# EAGLE schematic DRI-21700-flexpcb-12s4p (EAGLE 9.6.1)
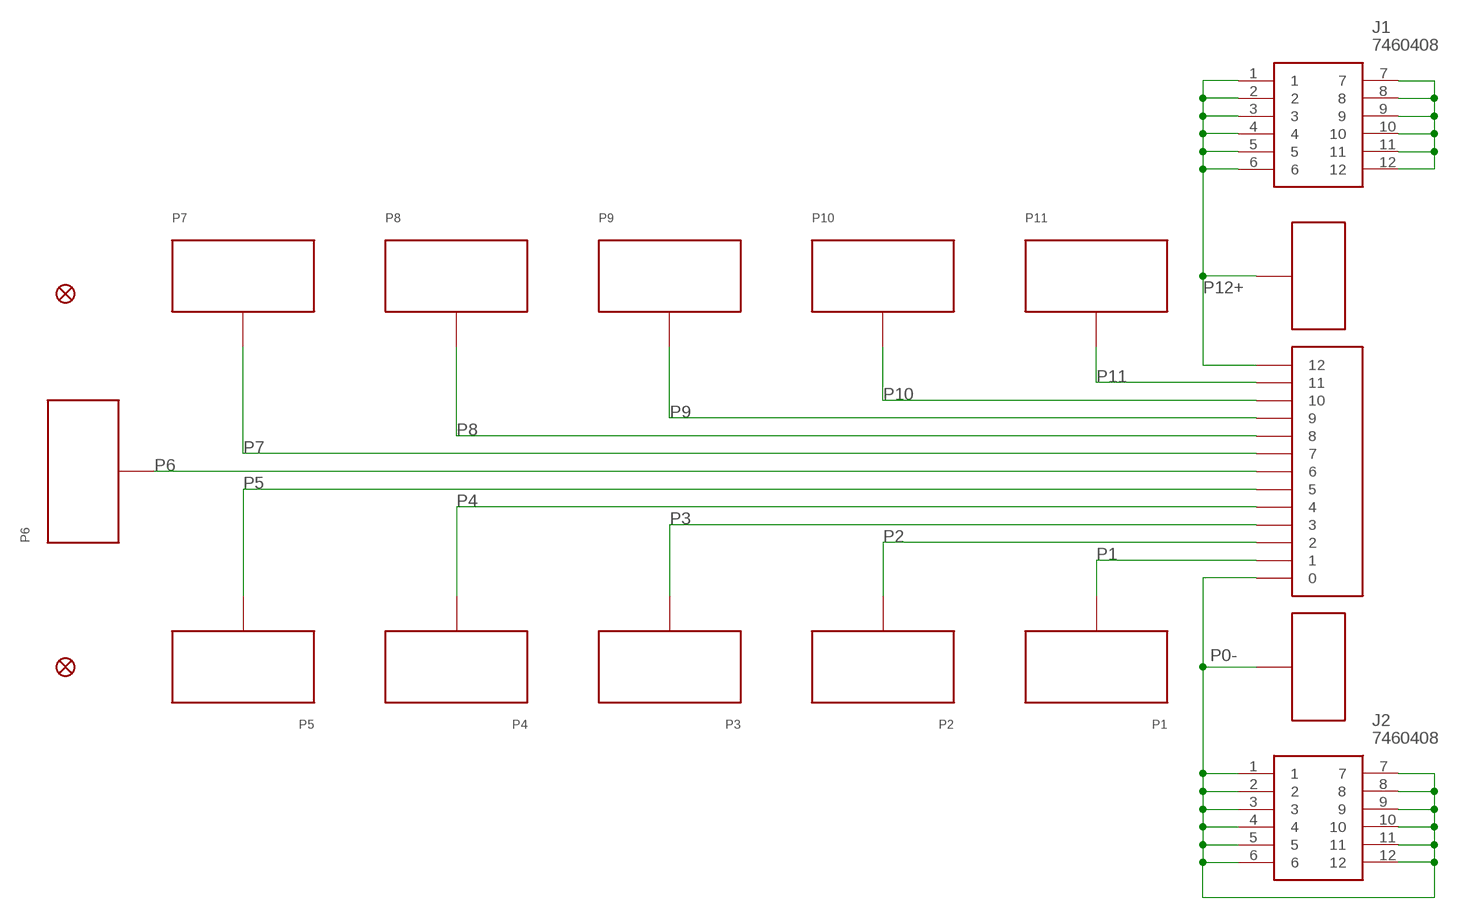
[diagram p0: schematic, sheet 1]

## Parts
FD1  FIDUCIAL1X2  [FIDUCIAL-1X2]
FD2  FIDUCIAL1X2  [FIDUCIAL-1X2]
J1  7460408  [7460408]
J2  7460408  [7460408]
JP1  13P-JST-2MM  [13P-JST-2MM]
P0  BUS-TERM-PAD+  [TERM-PAD-]
P1  BAT-TERM-L  [BAT-TERM-L]
P2  BAT-TERM-M  [BAT-TERM-M]
P3  BAT-TERM-L  [BAT-TERM-L]
P4  BAT-TERM-M  [BAT-TERM-M]
P5  BAT-TERM-L  [BAT-TERM-L]
P6  BAT-TERM-END  [BAT-TERM-END]
P7  BAT-TERM-L  [BAT-TERM-L]
P8  BAT-TERM-M  [BAT-TERM-M]
P9  BAT-TERM-L  [BAT-TERM-L]
P10  BAT-TERM-M  [BAT-TERM-M]
P11  BAT-TERM-L  [BAT-TERM-L]
P12  BUS-TERM-PAD+  [TERM-PAD-]

## Nets
N$2: J1.7 J1.8 J1.9 J1.10 J1.11 J1.12
P0-: J2.1 J2.2 J2.3 J2.4 J2.5 J2.6 J2.7 J2.8 J2.9 J2.10 J2.11 J2.12 JP1.P$1 P0.P$3 P0.P$4 P0.P$5 P0.P$6 P0.P$7 P0.P$8 P0.P$9 P0.P$10 P0.P$11 P0.P$12 P0.P$13 P0.P$14 P0.P$15 P0.P$16 P0.P$17 P0.P$18 P0.P$19 P0.P$20 P0.P$21 P0.P$22 P0.P$23 P0.P$24 P0.P$25 P0.P$26 P0.P$27 P0.P$28 P0.P$29 P0.P$30 P0.P$31 P0.P$32 P0.P$33 P0.P$34 P0.P$35 P0.P$36 P0.P$37 P0.P$38 P0.P$39 P0.P$40 P0.P$41 P0.P$42 P0.P$43 P0.P$44 P0.P$45 P0.P$46 P0.P$47 P0.P$48 P0.P$49 P0.P$50 P0.P$51 P0.P$52 P0.P$53 P0.P$54 P0.P$55 P0.P$56 P0.P$57 P0.P$58 P0.P$59 P0.P$60 P0.P$61 P0.P$62 P0.P$63 P0.P$64 P0.P$65 P0.P$66 P0.P$67 P0.P$68 P0.P$69 P0.P$70 P0.P$71 P0.P$72 P0.P$73 P0.P$74 P0.P$75 P0.P$76 P0.P$77 P0.P$78 P0.P$79 P0.P$80 P0.P$81 P0.P$82 P0.P$83 P0.P$84 P0.P$85 P0.P$86 P0.P$87 P0.P$88 P0.P$89 P0.P$90 P0.P$91 P0.P$92 P0.P$93 P0.P$94 P0.P$95 P0.P$96 P0.P$97 P0.P$98 P0.P$99 P0.P$100 P0.P$101 P0.P$102 P0.P$103 P0.P$104 P0.P$105 P0.P$106 P0.P$107 P0.P$108 P0.P$109 P0.P$110 P0.P$181 P0.P$182 P0.P$183 P0.P$184 P0.P$185 P0.P$186 P0.P$187 P0.P$188 P0.P$189 P0.P$190 P0.P$191 P0.P$192 P0.P$193 P0.P$194 P0.P$195 P0.P$196 P0.P$197 P0.P$198 P0.P$199 P0.P$200 P0.P$201 P0.P$202 P0.P$203 P0.P$204 P0.P$205 P0.P$206 P0.P$207 P0.P$208 P0.P$209 P0.P$210 P0.P$211 P0.P$212 P0.P$213 P0.P$214 P0.P$215 P0.P$216 P0.P$217 P0.P$218 P0.P$219 P0.P$220 P0.P$221 P0.P$222 P0.P$223 P0.P$224 P0.P$225 P0.P$226 P0.P$227 P0.P$228 P0.P$229 P0.P$230 P0.P$231 P0.P$232 P0.P$233 P0.P$234 P0.P$235 P0.P$236 P0.P$237 P0.P$238 P0.P$239 P0.P$240 P0.P$241 P0.P$242 P0.P$243 P0.P$244 P0.P$245 P0.P$246 P0.P$247 P0.P$248 P0.P$249 P0.P$250 P0.P$251 P0.P$252 P0.P$253 P0.P$254 P0.P$255 P0.P$256 P0.P$257 P0.P$258 P0.P$259 P0.P$260 P0.P$261 P0.P$262 P0.P$263 P0.P$264 P0.P$265 P0.P$266 P0.P$267 P0.P$268 P0.P$269 P0.P$270 P0.P$271 P0.P$272 P0.P$273 P0.P$274 P0.P$275 P0.P$276 P0.P$277 P0.P$278 P0.P$279 P0.P$280 P0.P$281 P0.P$282 P0.P$283 P0.P$284 P0.P$285 P0.P$286 P0.P$287 P0.P$288 P0.P$289 P0.P$290 P0.P$291 P0.P$292 P0.P$293 P0.P$294 P0.P$295 P0.P$296 P0.P$297 P0.P$298 P0.P$299 P0.P$300 P0.P$301 P0.P$302 P0.P$303 P0.P$304 P0.P$305 P0.P$306 P0.P$307 P0.P$308 P0.P$309 P0.P$310 P0.P$311 P0.P$312 P0.P$313 P0.P$314 P0.P$315 P0.P$316 P0.P$317 P0.P$318 P0.P$319 P0.P$320 P0.P$321 P0.P$322 P0.P$323 P0.P$324 P0.P$325 P0.P$326 P0.P$327 P0.P$328 P0.P$329 P0.P$330 P0.P$331 P0.P$332 P0.P$333 P0.P$334 P0.P$335 P0.P$336 P0.P$337 P0.P$338 P0.P$339 P0.P$340 P0.P$341 P0.P$342 P0.P$343 P0.P$344 P0.P$345 P0.P$346 P0.P$347 P0.P$348 P0.P$349 P0.P$350 P0.P$351 P0.P$352 P0.P$353 P0.P$354 P0.P$355 P0.P$356 P0.P$357 P0.P$358 P0.P$359 P0.P$360
P1: JP1.P$2 P1.P$5 P1.P$6 P1.P$7 P1.P$8 P1.P$9 P1.P$10 P1.P$11 P1.P$12 P1.P$13 P1.P$14 P1.P$15 P1.P$16 P1.P$17 P1.P$18 P1.P$19 P1.P$20 P1.P$21 P1.P$22 P1.P$23 P1.P$24 P1.P$25 P1.P$26 P1.P$27 P1.P$28 P1.P$29 P1.P$30 P1.P$31 P1.P$32 P1.P$33 P1.P$34 P1.P$35 P1.P$36 P1.P$37 P1.P$38 P1.P$39 P1.P$40 P1.P$41 P1.P$42 P1.P$43 P1.P$44 P1.P$45 P1.P$46 P1.P$47 P1.P$48 P1.P$49 P1.P$50 P1.P$51 P1.P$52 P1.P$53 P1.P$54 P1.P$55 P1.P$56 P1.P$57 P1.P$58 P1.P$59 P1.P$60 P1.P$61 P1.P$62 P1.P$63 P1.P$64 P1.P$65 P1.P$66 P1.P$67 P1.P$68 P1.P$69 P1.P$70 P1.P$71 P1.P$72 P1.P$73 P1.P$74 P1.P$75 P1.P$76 P1.P$77 P1.P$78 P1.P$79 P1.P$80 P1.P$81 P1.P$82 P1.P$83 P1.P$84 P1.P$85 P1.P$86 P1.P$87 P1.P$88 P1.P$89 P1.P$90 P1.P$91 P1.P$92 P1.P$93 P1.P$94 P1.P$95 P1.P$96 P1.P$97 P1.P$98 P1.P$99 P1.P$100 P1.P$101 P1.P$102 P1.P$103 P1.P$104 P1.P$105 P1.P$106 P1.P$107 P1.P$108 P1.P$109 P1.P$110 P1.P$111 P1.P$112 P1.P$114 P1.P$115 P1.P$116 P1.P$117 P1.P$118 P1.P$119 P1.P$120 P1.P$121 P1.P$122 P1.P$123 P1.P$124 P1.P$125 P1.P$126 P1.P$127 P1.P$128 P1.P$129 P1.P$130 P1.P$131 P1.P$132 P1.P$133 P1.P$134 P1.P$135 P1.P$136 P1.P$137 P1.P$138 P1.P$139 P1.P$140 P1.P$141 P1.P$142 P1.P$143 P1.P$144 P1.P$145 P1.P$146 P1.P$147 P1.P$148 P1.P$149 P1.P$151 P1.P$152 P1.P$153 P1.P$154 P1.P$155 P1.P$156 P1.P$157 P1.P$158 P1.P$159 P1.P$160 P1.P$161 P1.P$162 P1.P$163 P1.P$164 P1.P$165 P1.P$166 P1.P$167 P1.P$168 P1.P$169 P1.P$170 P1.P$171 P1.P$172 P1.P$173 P1.P$174 P1.P$175 P1.P$176 P1.P$177 P1.P$178 P1.P$179 P1.P$180 P1.P$181 P1.P$182 P1.P$183 P1.P$184 P1.P$185 P1.P$186 P1.P$188 P1.P$189 P1.P$190 P1.P$191 P1.P$192 P1.P$193 P1.P$194 P1.P$195 P1.P$196 P1.P$197 P1.P$198 P1.P$199 P1.P$200 P1.P$201 P1.P$202 P1.P$203 P1.P$204 P1.P$205 P1.P$206 P1.P$207 P1.P$208 P1.P$209 P1.P$210 P1.P$211 P1.P$212 P1.P$213 P1.P$214 P1.P$215 P1.P$216 P1.P$217 P1.P$218 P1.P$219 P1.P$220 P1.P$221 P1.P$222 P1.P$223
P2: JP1.P$3 P2.P$5 P2.P$6 P2.P$7 P2.P$8 P2.P$9 P2.P$10 P2.P$11 P2.P$12 P2.P$13 P2.P$14 P2.P$15 P2.P$16 P2.P$17 P2.P$18 P2.P$19 P2.P$20 P2.P$21 P2.P$22 P2.P$23 P2.P$24 P2.P$25 P2.P$26 P2.P$27 P2.P$28 P2.P$29 P2.P$30 P2.P$31 P2.P$32 P2.P$33 P2.P$34 P2.P$35 P2.P$36 P2.P$37 P2.P$38 P2.P$39 P2.P$40 P2.P$42 P2.P$43 P2.P$44 P2.P$45 P2.P$46 P2.P$47 P2.P$48 P2.P$49 P2.P$50 P2.P$51 P2.P$52 P2.P$53 P2.P$54 P2.P$55 P2.P$56 P2.P$57 P2.P$58 P2.P$59 P2.P$60 P2.P$61 P2.P$62 P2.P$63 P2.P$64 P2.P$65 P2.P$66 P2.P$67 P2.P$68 P2.P$69 P2.P$70 P2.P$71 P2.P$72 P2.P$73 P2.P$74 P2.P$75 P2.P$76 P2.P$77 P2.P$79 P2.P$80 P2.P$81 P2.P$82 P2.P$83 P2.P$84 P2.P$85 P2.P$86 P2.P$87 P2.P$88 P2.P$89 P2.P$90 P2.P$91 P2.P$92 P2.P$93 P2.P$94 P2.P$95 P2.P$96 P2.P$97 P2.P$98 P2.P$99 P2.P$100 P2.P$101 P2.P$102 P2.P$103 P2.P$104 P2.P$105 P2.P$106 P2.P$107 P2.P$108 P2.P$109 P2.P$110 P2.P$111 P2.P$112 P2.P$113 P2.P$114 P2.P$116 P2.P$117 P2.P$118 P2.P$119 P2.P$120 P2.P$121 P2.P$122 P2.P$123 P2.P$124 P2.P$125 P2.P$126 P2.P$127 P2.P$128 P2.P$129 P2.P$130 P2.P$131 P2.P$132 P2.P$133 P2.P$134 P2.P$135 P2.P$136 P2.P$137 P2.P$138 P2.P$139 P2.P$140 P2.P$141 P2.P$142 P2.P$143 P2.P$144 P2.P$145 P2.P$146 P2.P$147 P2.P$148 P2.P$149 P2.P$150 P2.P$151 P2.P$153 P2.P$154 P2.P$155 P2.P$156 P2.P$157 P2.P$158 P2.P$159 P2.P$160 P2.P$161 P2.P$162 P2.P$163 P2.P$164 P2.P$165 P2.P$166 P2.P$167 P2.P$168 P2.P$169 P2.P$170 P2.P$171 P2.P$172 P2.P$173 P2.P$174 P2.P$175 P2.P$176 P2.P$177 P2.P$178 P2.P$179 P2.P$180 P2.P$181 P2.P$182 P2.P$183 P2.P$184 P2.P$185 P2.P$186 P2.P$187 P2.P$188 P2.P$190 P2.P$191 P2.P$192 P2.P$193 P2.P$194 P2.P$195 P2.P$196 P2.P$197 P2.P$198 P2.P$199 P2.P$200 P2.P$201 P2.P$202 P2.P$203 P2.P$204 P2.P$205 P2.P$206 P2.P$207 P2.P$208 P2.P$209 P2.P$210 P2.P$211 P2.P$212 P2.P$213 P2.P$214 P2.P$215 P2.P$216 P2.P$217 P2.P$218 P2.P$219 P2.P$220 P2.P$221 P2.P$222 P2.P$223 P2.P$224 P2.P$225
P3: JP1.P$4 P3.P$5 P3.P$6 P3.P$7 P3.P$8 P3.P$9 P3.P$10 P3.P$11 P3.P$12 P3.P$13 P3.P$14 P3.P$15 P3.P$16 P3.P$17 P3.P$18 P3.P$19 P3.P$20 P3.P$21 P3.P$22 P3.P$23 P3.P$24 P3.P$25 P3.P$26 P3.P$27 P3.P$28 P3.P$29 P3.P$30 P3.P$31 P3.P$32 P3.P$33 P3.P$34 P3.P$35 P3.P$36 P3.P$37 P3.P$38 P3.P$39 P3.P$40 P3.P$41 P3.P$42 P3.P$43 P3.P$44 P3.P$45 P3.P$46 P3.P$47 P3.P$48 P3.P$49 P3.P$50 P3.P$51 P3.P$52 P3.P$53 P3.P$54 P3.P$55 P3.P$56 P3.P$57 P3.P$58 P3.P$59 P3.P$60 P3.P$61 P3.P$62 P3.P$63 P3.P$64 P3.P$65 P3.P$66 P3.P$67 P3.P$68 P3.P$69 P3.P$70 P3.P$71 P3.P$72 P3.P$73 P3.P$74 P3.P$75 P3.P$76 P3.P$77 P3.P$78 P3.P$79 P3.P$80 P3.P$81 P3.P$82 P3.P$83 P3.P$84 P3.P$85 P3.P$86 P3.P$87 P3.P$88 P3.P$89 P3.P$90 P3.P$91 P3.P$92 P3.P$93 P3.P$94 P3.P$95 P3.P$96 P3.P$97 P3.P$98 P3.P$99 P3.P$100 P3.P$101 P3.P$102 P3.P$103 P3.P$104 P3.P$105 P3.P$106 P3.P$107 P3.P$108 P3.P$109 P3.P$110 P3.P$111 P3.P$112 P3.P$114 P3.P$115 P3.P$116 P3.P$117 P3.P$118 P3.P$119 P3.P$120 P3.P$121 P3.P$122 P3.P$123 P3.P$124 P3.P$125 P3.P$126 P3.P$127 P3.P$128 P3.P$129 P3.P$130 P3.P$131 P3.P$132 P3.P$133 P3.P$134 P3.P$135 P3.P$136 P3.P$137 P3.P$138 P3.P$139 P3.P$140 P3.P$141 P3.P$142 P3.P$143 P3.P$144 P3.P$145 P3.P$146 P3.P$147 P3.P$148 P3.P$149 P3.P$151 P3.P$152 P3.P$153 P3.P$154 P3.P$155 P3.P$156 P3.P$157 P3.P$158 P3.P$159 P3.P$160 P3.P$161 P3.P$162 P3.P$163 P3.P$164 P3.P$165 P3.P$166 P3.P$167 P3.P$168 P3.P$169 P3.P$170 P3.P$171 P3.P$172 P3.P$173 P3.P$174 P3.P$175 P3.P$176 P3.P$177 P3.P$178 P3.P$179 P3.P$180 P3.P$181 P3.P$182 P3.P$183 P3.P$184 P3.P$185 P3.P$186 P3.P$188 P3.P$189 P3.P$190 P3.P$191 P3.P$192 P3.P$193 P3.P$194 P3.P$195 P3.P$196 P3.P$197 P3.P$198 P3.P$199 P3.P$200 P3.P$201 P3.P$202 P3.P$203 P3.P$204 P3.P$205 P3.P$206 P3.P$207 P3.P$208 P3.P$209 P3.P$210 P3.P$211 P3.P$212 P3.P$213 P3.P$214 P3.P$215 P3.P$216 P3.P$217 P3.P$218 P3.P$219 P3.P$220 P3.P$221 P3.P$222 P3.P$223
P4: JP1.P$5 P4.P$5 P4.P$6 P4.P$7 P4.P$8 P4.P$9 P4.P$10 P4.P$11 P4.P$12 P4.P$13 P4.P$14 P4.P$15 P4.P$16 P4.P$17 P4.P$18 P4.P$19 P4.P$20 P4.P$21 P4.P$22 P4.P$23 P4.P$24 P4.P$25 P4.P$26 P4.P$27 P4.P$28 P4.P$29 P4.P$30 P4.P$31 P4.P$32 P4.P$33 P4.P$34 P4.P$35 P4.P$36 P4.P$37 P4.P$38 P4.P$39 P4.P$40 P4.P$42 P4.P$43 P4.P$44 P4.P$45 P4.P$46 P4.P$47 P4.P$48 P4.P$49 P4.P$50 P4.P$51 P4.P$52 P4.P$53 P4.P$54 P4.P$55 P4.P$56 P4.P$57 P4.P$58 P4.P$59 P4.P$60 P4.P$61 P4.P$62 P4.P$63 P4.P$64 P4.P$65 P4.P$66 P4.P$67 P4.P$68 P4.P$69 P4.P$70 P4.P$71 P4.P$72 P4.P$73 P4.P$74 P4.P$75 P4.P$76 P4.P$77 P4.P$79 P4.P$80 P4.P$81 P4.P$82 P4.P$83 P4.P$84 P4.P$85 P4.P$86 P4.P$87 P4.P$88 P4.P$89 P4.P$90 P4.P$91 P4.P$92 P4.P$93 P4.P$94 P4.P$95 P4.P$96 P4.P$97 P4.P$98 P4.P$99 P4.P$100 P4.P$101 P4.P$102 P4.P$103 P4.P$104 P4.P$105 P4.P$106 P4.P$107 P4.P$108 P4.P$109 P4.P$110 P4.P$111 P4.P$112 P4.P$113 P4.P$114 P4.P$116 P4.P$117 P4.P$118 P4.P$119 P4.P$120 P4.P$121 P4.P$122 P4.P$123 P4.P$124 P4.P$125 P4.P$126 P4.P$127 P4.P$128 P4.P$129 P4.P$130 P4.P$131 P4.P$132 P4.P$133 P4.P$134 P4.P$135 P4.P$136 P4.P$137 P4.P$138 P4.P$139 P4.P$140 P4.P$141 P4.P$142 P4.P$143 P4.P$144 P4.P$145 P4.P$146 P4.P$147 P4.P$148 P4.P$149 P4.P$150 P4.P$151 P4.P$153 P4.P$154 P4.P$155 P4.P$156 P4.P$157 P4.P$158 P4.P$159 P4.P$160 P4.P$161 P4.P$162 P4.P$163 P4.P$164 P4.P$165 P4.P$166 P4.P$167 P4.P$168 P4.P$169 P4.P$170 P4.P$171 P4.P$172 P4.P$173 P4.P$174 P4.P$175 P4.P$176 P4.P$177 P4.P$178 P4.P$179 P4.P$180 P4.P$181 P4.P$182 P4.P$183 P4.P$184 P4.P$185 P4.P$186 P4.P$187 P4.P$188 P4.P$190 P4.P$191 P4.P$192 P4.P$193 P4.P$194 P4.P$195 P4.P$196 P4.P$197 P4.P$198 P4.P$199 P4.P$200 P4.P$201 P4.P$202 P4.P$203 P4.P$204 P4.P$205 P4.P$206 P4.P$207 P4.P$208 P4.P$209 P4.P$210 P4.P$211 P4.P$212 P4.P$213 P4.P$214 P4.P$215 P4.P$216 P4.P$217 P4.P$218 P4.P$219 P4.P$220 P4.P$221 P4.P$222 P4.P$223 P4.P$224 P4.P$225
P5: JP1.P$6 P5.P$5 P5.P$6 P5.P$7 P5.P$8 P5.P$9 P5.P$10 P5.P$11 P5.P$12 P5.P$13 P5.P$14 P5.P$15 P5.P$16 P5.P$17 P5.P$18 P5.P$19 P5.P$20 P5.P$21 P5.P$22 P5.P$23 P5.P$24 P5.P$25 P5.P$26 P5.P$27 P5.P$28 P5.P$29 P5.P$30 P5.P$31 P5.P$32 P5.P$33 P5.P$34 P5.P$35 P5.P$36 P5.P$37 P5.P$38 P5.P$39 P5.P$40 P5.P$41 P5.P$42 P5.P$43 P5.P$44 P5.P$45 P5.P$46 P5.P$47 P5.P$48 P5.P$49 P5.P$50 P5.P$51 P5.P$52 P5.P$53 P5.P$54 P5.P$55 P5.P$56 P5.P$57 P5.P$58 P5.P$59 P5.P$60 P5.P$61 P5.P$62 P5.P$63 P5.P$64 P5.P$65 P5.P$66 P5.P$67 P5.P$68 P5.P$69 P5.P$70 P5.P$71 P5.P$72 P5.P$73 P5.P$74 P5.P$75 P5.P$76 P5.P$77 P5.P$78 P5.P$79 P5.P$80 P5.P$81 P5.P$82 P5.P$83 P5.P$84 P5.P$85 P5.P$86 P5.P$87 P5.P$88 P5.P$89 P5.P$90 P5.P$91 P5.P$92 P5.P$93 P5.P$94 P5.P$95 P5.P$96 P5.P$97 P5.P$98 P5.P$99 P5.P$100 P5.P$101 P5.P$102 P5.P$103 P5.P$104 P5.P$105 P5.P$106 P5.P$107 P5.P$108 P5.P$109 P5.P$110 P5.P$111 P5.P$112 P5.P$114 P5.P$115 P5.P$116 P5.P$117 P5.P$118 P5.P$119 P5.P$120 P5.P$121 P5.P$122 P5.P$123 P5.P$124 P5.P$125 P5.P$126 P5.P$127 P5.P$128 P5.P$129 P5.P$130 P5.P$131 P5.P$132 P5.P$133 P5.P$134 P5.P$135 P5.P$136 P5.P$137 P5.P$138 P5.P$139 P5.P$140 P5.P$141 P5.P$142 P5.P$143 P5.P$144 P5.P$145 P5.P$146 P5.P$147 P5.P$148 P5.P$149 P5.P$151 P5.P$152 P5.P$153 P5.P$154 P5.P$155 P5.P$156 P5.P$157 P5.P$158 P5.P$159 P5.P$160 P5.P$161 P5.P$162 P5.P$163 P5.P$164 P5.P$165 P5.P$166 P5.P$167 P5.P$168 P5.P$169 P5.P$170 P5.P$171 P5.P$172 P5.P$173 P5.P$174 P5.P$175 P5.P$176 P5.P$177 P5.P$178 P5.P$179 P5.P$180 P5.P$181 P5.P$182 P5.P$183 P5.P$184 P5.P$185 P5.P$186 P5.P$188 P5.P$189 P5.P$190 P5.P$191 P5.P$192 P5.P$193 P5.P$194 P5.P$195 P5.P$196 P5.P$197 P5.P$198 P5.P$199 P5.P$200 P5.P$201 P5.P$202 P5.P$203 P5.P$204 P5.P$205 P5.P$206 P5.P$207 P5.P$208 P5.P$209 P5.P$210 P5.P$211 P5.P$212 P5.P$213 P5.P$214 P5.P$215 P5.P$216 P5.P$217 P5.P$218 P5.P$219 P5.P$220 P5.P$221 P5.P$222 P5.P$223
P6: JP1.P$7 P6.P$2 P6.P$3 P6.P$4 P6.P$5 P6.P$6 P6.P$7 P6.P$8 P6.P$9 P6.P$10 P6.P$11 P6.P$12 P6.P$13 P6.P$14 P6.P$15 P6.P$16 P6.P$17 P6.P$18 P6.P$19 P6.P$20 P6.P$21 P6.P$22 P6.P$23 P6.P$24 P6.P$25 P6.P$26 P6.P$27 P6.P$28 P6.P$29 P6.P$30 P6.P$31 P6.P$32 P6.P$33 P6.P$34 P6.P$35 P6.P$36 P6.P$37 P6.P$39 P6.P$40 P6.P$41 P6.P$42 P6.P$43 P6.P$44 P6.P$45 P6.P$46 P6.P$47 P6.P$48 P6.P$49 P6.P$50 P6.P$51 P6.P$52 P6.P$53 P6.P$54 P6.P$55 P6.P$56 P6.P$57 P6.P$58 P6.P$59 P6.P$60 P6.P$61 P6.P$62 P6.P$63 P6.P$64 P6.P$65 P6.P$66 P6.P$67 P6.P$68 P6.P$69 P6.P$70 P6.P$71 P6.P$72 P6.P$73 P6.P$74 P6.P$76 P6.P$77 P6.P$78 P6.P$79 P6.P$80 P6.P$81 P6.P$82 P6.P$83 P6.P$84 P6.P$85 P6.P$86 P6.P$87 P6.P$88 P6.P$89 P6.P$90 P6.P$91 P6.P$92 P6.P$93 P6.P$94 P6.P$95 P6.P$96 P6.P$97 P6.P$98 P6.P$99 P6.P$100 P6.P$101 P6.P$102 P6.P$103 P6.P$104 P6.P$105 P6.P$106 P6.P$107 P6.P$108 P6.P$109 P6.P$110 P6.P$111 P6.P$113 P6.P$114 P6.P$115 P6.P$116 P6.P$117 P6.P$118 P6.P$119 P6.P$120 P6.P$121 P6.P$122 P6.P$123 P6.P$124 P6.P$125 P6.P$126 P6.P$127 P6.P$128 P6.P$129 P6.P$130 P6.P$131 P6.P$132 P6.P$133 P6.P$134 P6.P$135 P6.P$136 P6.P$137 P6.P$138 P6.P$139 P6.P$140 P6.P$141 P6.P$142 P6.P$143 P6.P$144 P6.P$145 P6.P$146 P6.P$147 P6.P$148 P6.P$150 P6.P$151 P6.P$152 P6.P$153 P6.P$154 P6.P$155 P6.P$156 P6.P$157 P6.P$158 P6.P$159 P6.P$160 P6.P$161 P6.P$162 P6.P$163 P6.P$164 P6.P$165 P6.P$166 P6.P$167 P6.P$168 P6.P$169 P6.P$170 P6.P$171 P6.P$172 P6.P$173 P6.P$174 P6.P$175 P6.P$176 P6.P$177 P6.P$178 P6.P$179 P6.P$180 P6.P$181 P6.P$182 P6.P$183 P6.P$184 P6.P$185 P6.P$187 P6.P$188 P6.P$189 P6.P$190 P6.P$191 P6.P$192 P6.P$193 P6.P$194 P6.P$195 P6.P$196 P6.P$197 P6.P$198 P6.P$199 P6.P$200 P6.P$201 P6.P$202 P6.P$203 P6.P$204 P6.P$205 P6.P$206 P6.P$207 P6.P$208 P6.P$209 P6.P$210 P6.P$211 P6.P$212 P6.P$213 P6.P$214 P6.P$215 P6.P$216 P6.P$217 P6.P$218 P6.P$219 P6.P$220 P6.P$221 P6.P$222 P6.P$224 P6.P$225 P6.P$226 P6.P$227 P6.P$228 P6.P$229 P6.P$230 P6.P$231 P6.P$232 P6.P$233 P6.P$234 P6.P$235 P6.P$236 P6.P$237 P6.P$238 P6.P$239 P6.P$240 P6.P$241 P6.P$242 P6.P$243 P6.P$244 P6.P$245 P6.P$246 P6.P$247 P6.P$248 P6.P$249 P6.P$250 P6.P$251 P6.P$252 P6.P$253 P6.P$254 P6.P$255 P6.P$256 P6.P$257 P6.P$258 P6.P$259 P6.P$261 P6.P$262 P6.P$263 P6.P$264 P6.P$265 P6.P$266 P6.P$267 P6.P$268 P6.P$269 P6.P$270 P6.P$271 P6.P$272 P6.P$273 P6.P$274 P6.P$275 P6.P$276 P6.P$277 P6.P$278 P6.P$279 P6.P$280 P6.P$281 P6.P$282 P6.P$283 P6.P$284 P6.P$285 P6.P$286 P6.P$287 P6.P$288 P6.P$289 P6.P$290 P6.P$291 P6.P$292 P6.P$293 P6.P$294 P6.P$295 P6.P$296 P6.P$433 P6.P$434 P6.P$435 P6.P$436 P6.P$437 P6.P$438 P6.P$439 P6.P$440 P6.P$441 P6.P$442 P6.P$443 P6.P$444 P6.P$445 P6.P$446 P6.P$447 P6.P$448 P6.P$449 P6.P$450 P6.P$451 P6.P$452 P6.P$453 P6.P$454 P6.P$455 P6.P$456 P6.P$457 P6.P$458 P6.P$459 P6.P$460 P6.P$461 P6.P$462 P6.P$463 P6.P$464 P6.P$465 P6.P$466 P6.P$467 P6.P$468 P6.P$469 P6.P$470 P6.P$471 P6.P$472 P6.P$473 P6.P$474 P6.P$475 P6.P$476 P6.P$477 P6.P$478 P6.P$479 P6.P$480 P6.P$481 P6.P$482 P6.P$483 P6.P$484 P6.P$485 P6.P$486 P6.P$487 P6.P$488 P6.P$489 P6.P$490 P6.P$491 P6.P$492 P6.P$493 P6.P$494 P6.P$495 P6.P$496 P6.P$497 P6.P$498 P6.P$499 P6.P$500 P6.P$501 P6.P$502 P6.P$503 P6.P$504 P6.P$505 P6.P$506 P6.P$507 P6.P$508 P6.P$509 P6.P$510 P6.P$511 P6.P$512 P6.P$513 P6.P$514 P6.P$515 P6.P$516 P6.P$517 P6.P$518 P6.P$519 P6.P$520 P6.P$521 P6.P$522 P6.P$523 P6.P$524 P6.P$525 P6.P$526 P6.P$527 P6.P$528 P6.P$529 P6.P$530 P6.P$531 P6.P$532 P6.P$533 P6.P$534 P6.P$535 P6.P$536 P6.P$537 P6.P$538 P6.P$539 P6.P$540 P6.P$541 P6.P$542 P6.P$543 P6.P$544 P6.P$545 P6.P$546 P6.P$547 P6.P$548 P6.P$549 P6.P$550 P6.P$551 P6.P$552 P6.P$553 P6.P$554 P6.P$555 P6.P$556 P6.P$557 P6.P$558 P6.P$559 P6.P$560 P6.P$561 P6.P$562 P6.P$563 P6.P$564 P6.P$565 P6.P$566 P6.P$567 P6.P$568 P6.P$569 P6.P$570 P6.P$571 P6.P$572 P6.P$573 P6.P$574 P6.P$575 P6.P$576
P7: JP1.P$8 P7.P$5 P7.P$6 P7.P$7 P7.P$8 P7.P$9 P7.P$10 P7.P$11 P7.P$12 P7.P$13 P7.P$14 P7.P$15 P7.P$16 P7.P$17 P7.P$18 P7.P$19 P7.P$20 P7.P$21 P7.P$22 P7.P$23 P7.P$24 P7.P$25 P7.P$26 P7.P$27 P7.P$28 P7.P$29 P7.P$30 P7.P$31 P7.P$32 P7.P$33 P7.P$34 P7.P$35 P7.P$36 P7.P$37 P7.P$38 P7.P$39 P7.P$40 P7.P$41 P7.P$42 P7.P$43 P7.P$44 P7.P$45 P7.P$46 P7.P$47 P7.P$48 P7.P$49 P7.P$50 P7.P$51 P7.P$52 P7.P$53 P7.P$54 P7.P$55 P7.P$56 P7.P$57 P7.P$58 P7.P$59 P7.P$60 P7.P$61 P7.P$62 P7.P$63 P7.P$64 P7.P$65 P7.P$66 P7.P$67 P7.P$68 P7.P$69 P7.P$70 P7.P$71 P7.P$72 P7.P$73 P7.P$74 P7.P$75 P7.P$76 P7.P$77 P7.P$78 P7.P$79 P7.P$80 P7.P$81 P7.P$82 P7.P$83 P7.P$84 P7.P$85 P7.P$86 P7.P$87 P7.P$88 P7.P$89 P7.P$90 P7.P$91 P7.P$92 P7.P$93 P7.P$94 P7.P$95 P7.P$96 P7.P$97 P7.P$98 P7.P$99 P7.P$100 P7.P$101 P7.P$102 P7.P$103 P7.P$104 P7.P$105 P7.P$106 P7.P$107 P7.P$108 P7.P$109 P7.P$110 P7.P$111 P7.P$112 P7.P$114 P7.P$115 P7.P$116 P7.P$117 P7.P$118 P7.P$119 P7.P$120 P7.P$121 P7.P$122 P7.P$123 P7.P$124 P7.P$125 P7.P$126 P7.P$127 P7.P$128 P7.P$129 P7.P$130 P7.P$131 P7.P$132 P7.P$133 P7.P$134 P7.P$135 P7.P$136 P7.P$137 P7.P$138 P7.P$139 P7.P$140 P7.P$141 P7.P$142 P7.P$143 P7.P$144 P7.P$145 P7.P$146 P7.P$147 P7.P$148 P7.P$149 P7.P$151 P7.P$152 P7.P$153 P7.P$154 P7.P$155 P7.P$156 P7.P$157 P7.P$158 P7.P$159 P7.P$160 P7.P$161 P7.P$162 P7.P$163 P7.P$164 P7.P$165 P7.P$166 P7.P$167 P7.P$168 P7.P$169 P7.P$170 P7.P$171 P7.P$172 P7.P$173 P7.P$174 P7.P$175 P7.P$176 P7.P$177 P7.P$178 P7.P$179 P7.P$180 P7.P$181 P7.P$182 P7.P$183 P7.P$184 P7.P$185 P7.P$186 P7.P$188 P7.P$189 P7.P$190 P7.P$191 P7.P$192 P7.P$193 P7.P$194 P7.P$195 P7.P$196 P7.P$197 P7.P$198 P7.P$199 P7.P$200 P7.P$201 P7.P$202 P7.P$203 P7.P$204 P7.P$205 P7.P$206 P7.P$207 P7.P$208 P7.P$209 P7.P$210 P7.P$211 P7.P$212 P7.P$213 P7.P$214 P7.P$215 P7.P$216 P7.P$217 P7.P$218 P7.P$219 P7.P$220 P7.P$221 P7.P$222 P7.P$223
P8: JP1.P$9 P8.P$5 P8.P$6 P8.P$7 P8.P$8 P8.P$9 P8.P$10 P8.P$11 P8.P$12 P8.P$13 P8.P$14 P8.P$15 P8.P$16 P8.P$17 P8.P$18 P8.P$19 P8.P$20 P8.P$21 P8.P$22 P8.P$23 P8.P$24 P8.P$25 P8.P$26 P8.P$27 P8.P$28 P8.P$29 P8.P$30 P8.P$31 P8.P$32 P8.P$33 P8.P$34 P8.P$35 P8.P$36 P8.P$37 P8.P$38 P8.P$39 P8.P$40 P8.P$42 P8.P$43 P8.P$44 P8.P$45 P8.P$46 P8.P$47 P8.P$48 P8.P$49 P8.P$50 P8.P$51 P8.P$52 P8.P$53 P8.P$54 P8.P$55 P8.P$56 P8.P$57 P8.P$58 P8.P$59 P8.P$60 P8.P$61 P8.P$62 P8.P$63 P8.P$64 P8.P$65 P8.P$66 P8.P$67 P8.P$68 P8.P$69 P8.P$70 P8.P$71 P8.P$72 P8.P$73 P8.P$74 P8.P$75 P8.P$76 P8.P$77 P8.P$79 P8.P$80 P8.P$81 P8.P$82 P8.P$83 P8.P$84 P8.P$85 P8.P$86 P8.P$87 P8.P$88 P8.P$89 P8.P$90 P8.P$91 P8.P$92 P8.P$93 P8.P$94 P8.P$95 P8.P$96 P8.P$97 P8.P$98 P8.P$99 P8.P$100 P8.P$101 P8.P$102 P8.P$103 P8.P$104 P8.P$105 P8.P$106 P8.P$107 P8.P$108 P8.P$109 P8.P$110 P8.P$111 P8.P$112 P8.P$113 P8.P$114 P8.P$116 P8.P$117 P8.P$118 P8.P$119 P8.P$120 P8.P$121 P8.P$122 P8.P$123 P8.P$124 P8.P$125 P8.P$126 P8.P$127 P8.P$128 P8.P$129 P8.P$130 P8.P$131 P8.P$132 P8.P$133 P8.P$134 P8.P$135 P8.P$136 P8.P$137 P8.P$138 P8.P$139 P8.P$140 P8.P$141 P8.P$142 P8.P$143 P8.P$144 P8.P$145 P8.P$146 P8.P$147 P8.P$148 P8.P$149 P8.P$150 P8.P$151 P8.P$153 P8.P$154 P8.P$155 P8.P$156 P8.P$157 P8.P$158 P8.P$159 P8.P$160 P8.P$161 P8.P$162 P8.P$163 P8.P$164 P8.P$165 P8.P$166 P8.P$167 P8.P$168 P8.P$169 P8.P$170 P8.P$171 P8.P$172 P8.P$173 P8.P$174 P8.P$175 P8.P$176 P8.P$177 P8.P$178 P8.P$179 P8.P$180 P8.P$181 P8.P$182 P8.P$183 P8.P$184 P8.P$185 P8.P$186 P8.P$187 P8.P$188 P8.P$190 P8.P$191 P8.P$192 P8.P$193 P8.P$194 P8.P$195 P8.P$196 P8.P$197 P8.P$198 P8.P$199 P8.P$200 P8.P$201 P8.P$202 P8.P$203 P8.P$204 P8.P$205 P8.P$206 P8.P$207 P8.P$208 P8.P$209 P8.P$210 P8.P$211 P8.P$212 P8.P$213 P8.P$214 P8.P$215 P8.P$216 P8.P$217 P8.P$218 P8.P$219 P8.P$220 P8.P$221 P8.P$222 P8.P$223 P8.P$224 P8.P$225
P9: JP1.P$10 P9.P$5 P9.P$6 P9.P$7 P9.P$8 P9.P$9 P9.P$10 P9.P$11 P9.P$12 P9.P$13 P9.P$14 P9.P$15 P9.P$16 P9.P$17 P9.P$18 P9.P$19 P9.P$20 P9.P$21 P9.P$22 P9.P$23 P9.P$24 P9.P$25 P9.P$26 P9.P$27 P9.P$28 P9.P$29 P9.P$30 P9.P$31 P9.P$32 P9.P$33 P9.P$34 P9.P$35 P9.P$36 P9.P$37 P9.P$38 P9.P$39 P9.P$40 P9.P$41 P9.P$42 P9.P$43 P9.P$44 P9.P$45 P9.P$46 P9.P$47 P9.P$48 P9.P$49 P9.P$50 P9.P$51 P9.P$52 P9.P$53 P9.P$54 P9.P$55 P9.P$56 P9.P$57 P9.P$58 P9.P$59 P9.P$60 P9.P$61 P9.P$62 P9.P$63 P9.P$64 P9.P$65 P9.P$66 P9.P$67 P9.P$68 P9.P$69 P9.P$70 P9.P$71 P9.P$72 P9.P$73 P9.P$74 P9.P$75 P9.P$76 P9.P$77 P9.P$78 P9.P$79 P9.P$80 P9.P$81 P9.P$82 P9.P$83 P9.P$84 P9.P$85 P9.P$86 P9.P$87 P9.P$88 P9.P$89 P9.P$90 P9.P$91 P9.P$92 P9.P$93 P9.P$94 P9.P$95 P9.P$96 P9.P$97 P9.P$98 P9.P$99 P9.P$100 P9.P$101 P9.P$102 P9.P$103 P9.P$104 P9.P$105 P9.P$106 P9.P$107 P9.P$108 P9.P$109 P9.P$110 P9.P$111 P9.P$112 P9.P$114 P9.P$115 P9.P$116 P9.P$117 P9.P$118 P9.P$119 P9.P$120 P9.P$121 P9.P$122 P9.P$123 P9.P$124 P9.P$125 P9.P$126 P9.P$127 P9.P$128 P9.P$129 P9.P$130 P9.P$131 P9.P$132 P9.P$133 P9.P$134 P9.P$135 P9.P$136 P9.P$137 P9.P$138 P9.P$139 P9.P$140 P9.P$141 P9.P$142 P9.P$143 P9.P$144 P9.P$145 P9.P$146 P9.P$147 P9.P$148 P9.P$149 P9.P$151 P9.P$152 P9.P$153 P9.P$154 P9.P$155 P9.P$156 P9.P$157 P9.P$158 P9.P$159 P9.P$160 P9.P$161 P9.P$162 P9.P$163 P9.P$164 P9.P$165 P9.P$166 P9.P$167 P9.P$168 P9.P$169 P9.P$170 P9.P$171 P9.P$172 P9.P$173 P9.P$174 P9.P$175 P9.P$176 P9.P$177 P9.P$178 P9.P$179 P9.P$180 P9.P$181 P9.P$182 P9.P$183 P9.P$184 P9.P$185 P9.P$186 P9.P$188 P9.P$189 P9.P$190 P9.P$191 P9.P$192 P9.P$193 P9.P$194 P9.P$195 P9.P$196 P9.P$197 P9.P$198 P9.P$199 P9.P$200 P9.P$201 P9.P$202 P9.P$203 P9.P$204 P9.P$205 P9.P$206 P9.P$207 P9.P$208 P9.P$209 P9.P$210 P9.P$211 P9.P$212 P9.P$213 P9.P$214 P9.P$215 P9.P$216 P9.P$217 P9.P$218 P9.P$219 P9.P$220 P9.P$221 P9.P$222 P9.P$223
P10: JP1.P$11 P10.P$5 P10.P$6 P10.P$7 P10.P$8 P10.P$9 P10.P$10 P10.P$11 P10.P$12 P10.P$13 P10.P$14 P10.P$15 P10.P$16 P10.P$17 P10.P$18 P10.P$19 P10.P$20 P10.P$21 P10.P$22 P10.P$23 P10.P$24 P10.P$25 P10.P$26 P10.P$27 P10.P$28 P10.P$29 P10.P$30 P10.P$31 P10.P$32 P10.P$33 P10.P$34 P10.P$35 P10.P$36 P10.P$37 P10.P$38 P10.P$39 P10.P$40 P10.P$42 P10.P$43 P10.P$44 P10.P$45 P10.P$46 P10.P$47 P10.P$48 P10.P$49 P10.P$50 P10.P$51 P10.P$52 P10.P$53 P10.P$54 P10.P$55 P10.P$56 P10.P$57 P10.P$58 P10.P$59 P10.P$60 P10.P$61 P10.P$62 P10.P$63 P10.P$64 P10.P$65 P10.P$66 P10.P$67 P10.P$68 P10.P$69 P10.P$70 P10.P$71 P10.P$72 P10.P$73 P10.P$74 P10.P$75 P10.P$76 P10.P$77 P10.P$79 P10.P$80 P10.P$81 P10.P$82 P10.P$83 P10.P$84 P10.P$85 P10.P$86 P10.P$87 P10.P$88 P10.P$89 P10.P$90 P10.P$91 P10.P$92 P10.P$93 P10.P$94 P10.P$95 P10.P$96 P10.P$97 P10.P$98 P10.P$99 P10.P$100 P10.P$101 P10.P$102 P10.P$103 P10.P$104 P10.P$105 P10.P$106 P10.P$107 P10.P$108 P10.P$109 P10.P$110 P10.P$111 P10.P$112 P10.P$113 P10.P$114 P10.P$116 P10.P$117 P10.P$118 P10.P$119 P10.P$120 P10.P$121 P10.P$122 P10.P$123 P10.P$124 P10.P$125 P10.P$126 P10.P$127 P10.P$128 P10.P$129 P10.P$130 P10.P$131 P10.P$132 P10.P$133 P10.P$134 P10.P$135 P10.P$136 P10.P$137 P10.P$138 P10.P$139 P10.P$140 P10.P$141 P10.P$142 P10.P$143 P10.P$144 P10.P$145 P10.P$146 P10.P$147 P10.P$148 P10.P$149 P10.P$150 P10.P$151 P10.P$153 P10.P$154 P10.P$155 P10.P$156 P10.P$157 P10.P$158 P10.P$159 P10.P$160 P10.P$161 P10.P$162 P10.P$163 P10.P$164 P10.P$165 P10.P$166 P10.P$167 P10.P$168 P10.P$169 P10.P$170 P10.P$171 P10.P$172 P10.P$173 P10.P$174 P10.P$175 P10.P$176 P10.P$177 P10.P$178 P10.P$179 P10.P$180 P10.P$181 P10.P$182 P10.P$183 P10.P$184 P10.P$185 P10.P$186 P10.P$187 P10.P$188 P10.P$190 P10.P$191 P10.P$192 P10.P$193 P10.P$194 P10.P$195 P10.P$196 P10.P$197 P10.P$198 P10.P$199 P10.P$200 P10.P$201 P10.P$202 P10.P$203 P10.P$204 P10.P$205 P10.P$206 P10.P$207 P10.P$208 P10.P$209 P10.P$210 P10.P$211 P10.P$212 P10.P$213 P10.P$214 P10.P$215 P10.P$216 P10.P$217 P10.P$218 P10.P$219 P10.P$220 P10.P$221 P10.P$222 P10.P$223 P10.P$224 P10.P$225
P11: JP1.P$12 P11.P$5 P11.P$6 P11.P$7 P11.P$8 P11.P$9 P11.P$10 P11.P$11 P11.P$12 P11.P$13 P11.P$14 P11.P$15 P11.P$16 P11.P$17 P11.P$18 P11.P$19 P11.P$20 P11.P$21 P11.P$22 P11.P$23 P11.P$24 P11.P$25 P11.P$26 P11.P$27 P11.P$28 P11.P$29 P11.P$30 P11.P$31 P11.P$32 P11.P$33 P11.P$34 P11.P$35 P11.P$36 P11.P$37 P11.P$38 P11.P$39 P11.P$40 P11.P$41 P11.P$42 P11.P$43 P11.P$44 P11.P$45 P11.P$46 P11.P$47 P11.P$48 P11.P$49 P11.P$50 P11.P$51 P11.P$52 P11.P$53 P11.P$54 P11.P$55 P11.P$56 P11.P$57 P11.P$58 P11.P$59 P11.P$60 P11.P$61 P11.P$62 P11.P$63 P11.P$64 P11.P$65 P11.P$66 P11.P$67 P11.P$68 P11.P$69 P11.P$70 P11.P$71 P11.P$72 P11.P$73 P11.P$74 P11.P$75 P11.P$76 P11.P$77 P11.P$78 P11.P$79 P11.P$80 P11.P$81 P11.P$82 P11.P$83 P11.P$84 P11.P$85 P11.P$86 P11.P$87 P11.P$88 P11.P$89 P11.P$90 P11.P$91 P11.P$92 P11.P$93 P11.P$94 P11.P$95 P11.P$96 P11.P$97 P11.P$98 P11.P$99 P11.P$100 P11.P$101 P11.P$102 P11.P$103 P11.P$104 P11.P$105 P11.P$106 P11.P$107 P11.P$108 P11.P$109 P11.P$110 P11.P$111 P11.P$112 P11.P$114 P11.P$115 P11.P$116 P11.P$117 P11.P$118 P11.P$119 P11.P$120 P11.P$121 P11.P$122 P11.P$123 P11.P$124 P11.P$125 P11.P$126 P11.P$127 P11.P$128 P11.P$129 P11.P$130 P11.P$131 P11.P$132 P11.P$133 P11.P$134 P11.P$135 P11.P$136 P11.P$137 P11.P$138 P11.P$139 P11.P$140 P11.P$141 P11.P$142 P11.P$143 P11.P$144 P11.P$145 P11.P$146 P11.P$147 P11.P$148 P11.P$149 P11.P$151 P11.P$152 P11.P$153 P11.P$154 P11.P$155 P11.P$156 P11.P$157 P11.P$158 P11.P$159 P11.P$160 P11.P$161 P11.P$162 P11.P$163 P11.P$164 P11.P$165 P11.P$166 P11.P$167 P11.P$168 P11.P$169 P11.P$170 P11.P$171 P11.P$172 P11.P$173 P11.P$174 P11.P$175 P11.P$176 P11.P$177 P11.P$178 P11.P$179 P11.P$180 P11.P$181 P11.P$182 P11.P$183 P11.P$184 P11.P$185 P11.P$186 P11.P$188 P11.P$189 P11.P$190 P11.P$191 P11.P$192 P11.P$193 P11.P$194 P11.P$195 P11.P$196 P11.P$197 P11.P$198 P11.P$199 P11.P$200 P11.P$201 P11.P$202 P11.P$203 P11.P$204 P11.P$205 P11.P$206 P11.P$207 P11.P$208 P11.P$209 P11.P$210 P11.P$211 P11.P$212 P11.P$213 P11.P$214 P11.P$215 P11.P$216 P11.P$217 P11.P$218 P11.P$219 P11.P$220 P11.P$221 P11.P$222 P11.P$223
P12+: J1.1 J1.2 J1.3 J1.4 J1.5 J1.6 JP1.P$13 P12.P$3 P12.P$4 P12.P$5 P12.P$6 P12.P$7 P12.P$8 P12.P$9 P12.P$10 P12.P$11 P12.P$12 P12.P$13 P12.P$14 P12.P$15 P12.P$16 P12.P$17 P12.P$18 P12.P$19 P12.P$20 P12.P$21 P12.P$22 P12.P$23 P12.P$24 P12.P$25 P12.P$26 P12.P$27 P12.P$28 P12.P$29 P12.P$30 P12.P$31 P12.P$32 P12.P$33 P12.P$34 P12.P$35 P12.P$36 P12.P$37 P12.P$38 P12.P$39 P12.P$40 P12.P$41 P12.P$42 P12.P$43 P12.P$44 P12.P$45 P12.P$46 P12.P$47 P12.P$48 P12.P$49 P12.P$50 P12.P$51 P12.P$52 P12.P$53 P12.P$54 P12.P$55 P12.P$56 P12.P$57 P12.P$58 P12.P$59 P12.P$60 P12.P$61 P12.P$62 P12.P$63 P12.P$64 P12.P$65 P12.P$66 P12.P$67 P12.P$68 P12.P$69 P12.P$70 P12.P$71 P12.P$72 P12.P$73 P12.P$74 P12.P$75 P12.P$76 P12.P$77 P12.P$78 P12.P$79 P12.P$80 P12.P$81 P12.P$82 P12.P$83 P12.P$84 P12.P$85 P12.P$86 P12.P$87 P12.P$88 P12.P$89 P12.P$90 P12.P$91 P12.P$92 P12.P$93 P12.P$94 P12.P$95 P12.P$96 P12.P$97 P12.P$98 P12.P$99 P12.P$100 P12.P$101 P12.P$102 P12.P$103 P12.P$104 P12.P$105 P12.P$106 P12.P$107 P12.P$108 P12.P$109 P12.P$110 P12.P$181 P12.P$182 P12.P$183 P12.P$184 P12.P$185 P12.P$186 P12.P$187 P12.P$188 P12.P$189 P12.P$190 P12.P$191 P12.P$192 P12.P$193 P12.P$194 P12.P$195 P12.P$196 P12.P$197 P12.P$198 P12.P$199 P12.P$200 P12.P$201 P12.P$202 P12.P$203 P12.P$204 P12.P$205 P12.P$206 P12.P$207 P12.P$208 P12.P$209 P12.P$210 P12.P$211 P12.P$212 P12.P$213 P12.P$214 P12.P$215 P12.P$216 P12.P$217 P12.P$218 P12.P$219 P12.P$220 P12.P$221 P12.P$222 P12.P$223 P12.P$224 P12.P$225 P12.P$226 P12.P$227 P12.P$228 P12.P$229 P12.P$230 P12.P$231 P12.P$232 P12.P$233 P12.P$234 P12.P$235 P12.P$236 P12.P$237 P12.P$238 P12.P$239 P12.P$240 P12.P$241 P12.P$242 P12.P$243 P12.P$244 P12.P$245 P12.P$246 P12.P$247 P12.P$248 P12.P$249 P12.P$250 P12.P$251 P12.P$252 P12.P$253 P12.P$254 P12.P$255 P12.P$256 P12.P$257 P12.P$258 P12.P$259 P12.P$260 P12.P$261 P12.P$262 P12.P$263 P12.P$264 P12.P$265 P12.P$266 P12.P$267 P12.P$268 P12.P$269 P12.P$270 P12.P$271 P12.P$272 P12.P$273 P12.P$274 P12.P$275 P12.P$276 P12.P$277 P12.P$278 P12.P$279 P12.P$280 P12.P$281 P12.P$282 P12.P$283 P12.P$284 P12.P$285 P12.P$286 P12.P$287 P12.P$288 P12.P$289 P12.P$290 P12.P$291 P12.P$292 P12.P$293 P12.P$294 P12.P$295 P12.P$296 P12.P$297 P12.P$298 P12.P$299 P12.P$300 P12.P$301 P12.P$302 P12.P$303 P12.P$304 P12.P$305 P12.P$306 P12.P$307 P12.P$308 P12.P$309 P12.P$310 P12.P$311 P12.P$312 P12.P$313 P12.P$314 P12.P$315 P12.P$316 P12.P$317 P12.P$318 P12.P$319 P12.P$320 P12.P$321 P12.P$322 P12.P$323 P12.P$324 P12.P$325 P12.P$326 P12.P$327 P12.P$328 P12.P$329 P12.P$330 P12.P$331 P12.P$332 P12.P$333 P12.P$334 P12.P$335 P12.P$336 P12.P$337 P12.P$338 P12.P$339 P12.P$340 P12.P$341 P12.P$342 P12.P$343 P12.P$344 P12.P$345 P12.P$346 P12.P$347 P12.P$348 P12.P$349 P12.P$350 P12.P$351 P12.P$352 P12.P$353 P12.P$354 P12.P$355 P12.P$356 P12.P$357 P12.P$358 P12.P$359 P12.P$360

## Library data of the parts
FD1 FD2 = SparkFun-Aesthetics:FIDUCIAL: Fiducial Alignment Points Point-of-reference for pick-and-place machines and other optical instruments.
J1 J2 = SamacSys_Parts:7460408: Wurth Elektronik REDCUBE 12 Pin Power Element, 175A, Press Fit, M5, Vertical Source: Datasheet <https://componentsearchengine.com/Datasheets/1/7460408.pdf>; DESCRIPTION: Wurth Elektronik REDCUBE 12 Pin Power Element, 175A, Press Fit, M5, Vertical; HEIGHT: 6mm; MANUFACTURER_NAME: Wurth Elektronik; MANUFACTURER_PART_NUMBER: 7460408; MOUSER_PART_NUMBER: 710-7460408; MOUSER_PRICE-STOCK: https://www.mouser.com/Search/Refine.aspx?Keyword=710-7460408
JP1 = osrr-exp:13P-JST-2MM
P0 P12 = osrr-exp:BUS-TERM-PAD+
P1 P3 P5 P7 P9 P11 = osrr-exp:BAT-TERM-L
P2 P4 P8 P10 = osrr-exp:BAT-TERM-M
P6 = osrr-exp:BAT-TERM-END